# EAGLE design IRAMX-drv-v2 (EAGLE 6.5.0)
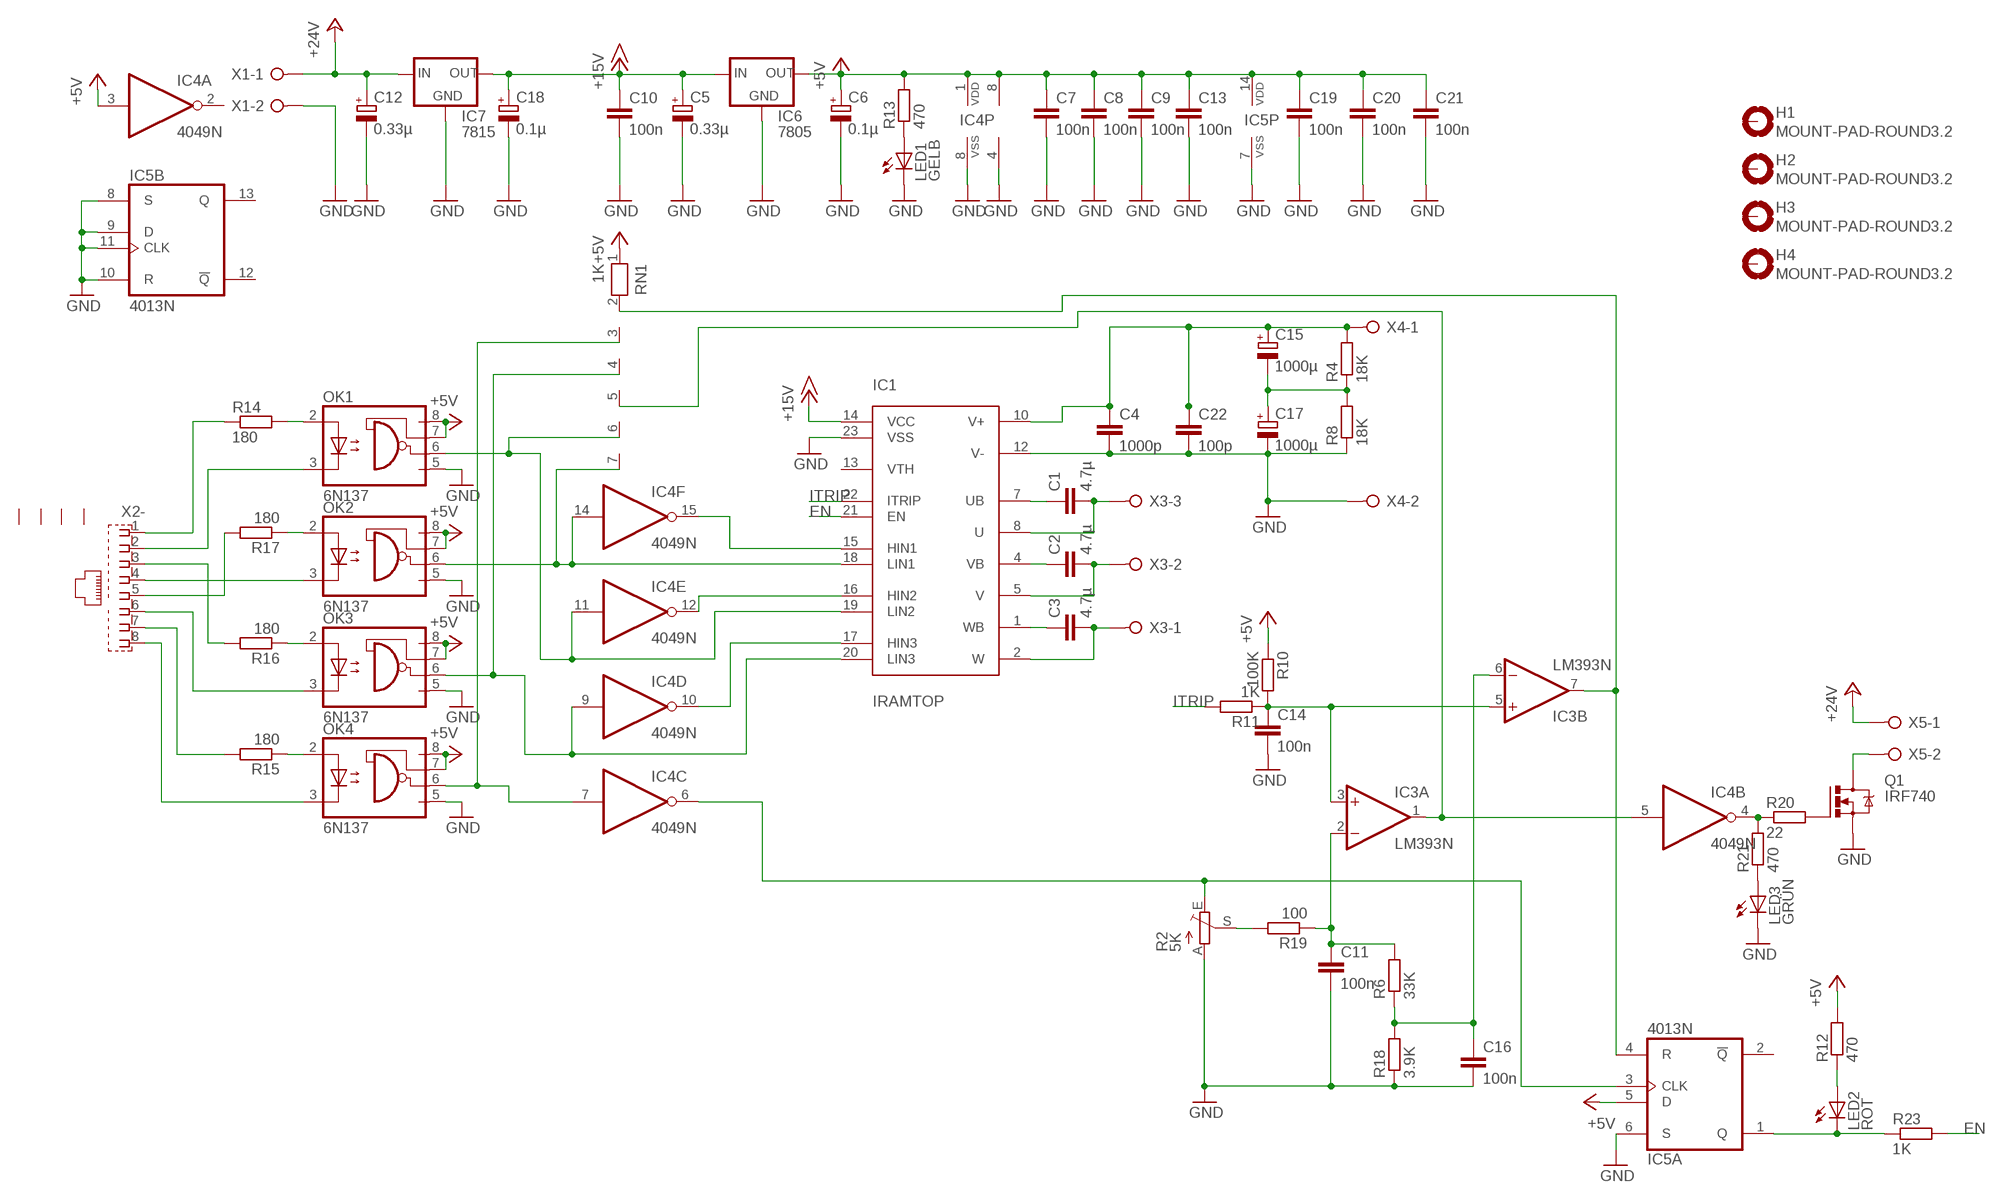
[diagram p0: schematic, sheet 1]

## Parts
C1  4.7µ  C5/7.2  [C5B7.2]
C2  4.7µ  C5/7.2  [C5B7.2]
C3  4.7µ  C5/7.2  [C5B7.2]
C4  1000p  C5/5  [C5B5]
C5  0.33µ  CPOL-EUE2.5-5  [E2,5-5]
C6  0.1µ  CPOL-EUE2.5-5  [E2,5-5]
C7  100n  C-EU050-025X075  [C050-025X075]
C8  100n  C-EU050-025X075  [C050-025X075]
C9  100n  C-EU050-025X075  [C050-025X075]
C10  100n  C-EU050-025X075  [C050-025X075]
C11  100n  C-EU050-025X075  [C050-025X075]
C12  0.33µ  CPOL-EUE2.5-5  [E2,5-5]
C13  100n  C-EU050-025X075  [C050-025X075]
C14  100n  C-EU050-025X075  [C050-025X075]
C15  1000µ  CPOL-EUE10-25  [EB25D]
C16  100n  C-EU050-025X075  [C050-025X075]
C17  1000µ  CPOL-EUE10-25  [EB25D]
C18  0.1µ  CPOL-EUE2.5-5  [E2,5-5]
C19  100n  C-EU050-025X075  [C050-025X075]
C20  100n  C-EU050-025X075  [C050-025X075]
C21  100n  C-EU050-025X075  [C050-025X075]
C22  100p  C-EU150-054X183  [C150-054X183]
H1  MOUNT-PAD-ROUND3.2  [3,2-PAD]
H2  MOUNT-PAD-ROUND3.2  [3,2-PAD]
H3  MOUNT-PAD-ROUND3.2  [3,2-PAD]
H4  MOUNT-PAD-ROUND3.2  [3,2-PAD]
IC1  IRAMTOP  [SIP23_TOP]
IC3  LM393N  [DIL08]
IC4  4049N  [DIL16]
IC5  4013N  [DIL14]
IC6  7805  78XXS  [78XXS]
IC7  7815  78XXS  [78XXS]
LED1  GELB  LED5MM  [LED5MM]
LED2  ROT  LED5MM  [LED5MM]
LED3  GRÜN  LED5MM  [LED5MM]
OK1  6N137  [DIL08]
OK2  6N137  [DIL08]
OK3  6N137  [DIL08]
OK4  6N137  [DIL08]
Q1  IRF740  [TO220BV]
R2  5K  TRIM_EU-CA6V  [CA6V]
R4  18K  R-EU_  [CER]
R6  33K  R-EU_0204/7  [0204/7]
R8  18K  R-EU_  [CER]
R10  100K  R-EU_0204/7  [0204/7]
R11  1K  R-EU_0204/7  [0204/7]
R12  470  R-EU_0204/7  [0204/7]
R13  470  R-EU_0204/7  [0204/7]
R14  180  R-EU_0204/2V  [0204V]
R15  180  R-EU_0204/2V  [0204V]
R16  180  R-EU_0204/2V  [0204V]
R17  180  R-EU_0204/2V  [0204V]
R18  3.9K  R-EU_0204/7  [0204/7]
R19  100  R-EU_0204/7  [0204/7]
R20  22  R-EU_0204/7  [0204/7]
R21  470  R-EU_0204/7  [0204/7]
R23  1K  R-EU_0204/7  [0204/7]
RN1  1K  RN06  [RN-7]
X1  W237-02P  [W237-132]
X2  RJ45  [RJ45]
X3  W237-03P  [W237-133]
X4  W237-02P  [W237-132]
X5  W237-02P  [W237-132]

## Nets
+5V: C6.+ C7.1 C8.1 C9.1 C13.1 C19.1 C20.1 C21.1 IC3.8(P:V+) IC4.1(P:VDD) IC4.3(A:I) IC5.5(A:D) IC5.14(P:VDD) IC6.OUT OK1.7(VE) OK1.8(VCC) OK2.7(VE) OK2.8(VCC) OK3.7(VE) OK3.8(VCC) OK4.7(VE) OK4.8(VCC) R10.1 R12.2 R13.2 RN1.1
+15V: C5.+ C10.1 C18.+ IC1.14(VCC) IC6.IN IC7.OUT
+24V: C12.+ IC7.IN X1.1 X5.1
EN: IC1.21(EN) R23.2
GND: C4.2 C5.- C6.- C7.2 C8.2 C9.2 C10.2 C11.2 C12.- C13.2 C14.2 C16.2 C17.- C18.- C19.2 C20.2 C21.2 C22.2 IC1.12(V-) IC1.23(VSS) IC3.4(P:V-) IC4.8(P:VSS) IC5.6(A:S) IC5.7(P:VSS) IC5.8(B:S) IC5.9(B:D) IC5.10(B:R) IC5.11(B:CLK) IC6.GND IC7.GND LED1.K(C) LED3.K(C) OK1.5(GND) OK2.5(GND) OK3.5(GND) OK4.5(GND) Q1.S R2.A R8.P$1 R18.1 X1.2 X4.2
ITRIP: IC1.22(ITRIP) R11.2
N$1 [iso]: C1.1 IC1.7(UB)
N$2 [dick]: C1.2 IC1.8(U) X3.3
N$3 [iso]: C2.1 IC1.4(VB)
N$4 [dick]: C2.2 IC1.5(V) X3.2
N$5 [iso]: C3.1 IC1.1(WB)
N$6 [dick]: C3.2 IC1.2(W) X3.1
N$7: LED2.A R12.1
N$8: C14.1 IC3.3(A:+IN) IC3.5(B:+IN) R10.2 R11.1
N$9: LED3.A R21.1
N$10: IC3.1(A:OUT) IC4.5(B:I) RN1.5
N$11 [dick]: C15.- C17.+ R4.P$1 R8.P$2
N$12: IC1.15(HIN1) IC4.15(F:O)
N$13: IC1.16(HIN2) IC4.12(E:O)
N$14: IC4.6(C:O) IC5.3(A:CLK) R2.E
N$15: IC1.17(HIN3) IC4.10(D:O)
N$16: OK3.3(C) X2.6
N$17: R16.2 X2.3
N$18: OK4.3(C) X2.8
N$19: OK2.3(C) X2.4
N$20: OK1.3(C) X2.2
N$21: OK1.2(A) R14.2
N$22: R17.2 X2.5
N$23: R15.2 X2.7
N$24: IC1.18(LIN1) IC4.14(F:I) OK2.6(VO) RN1.7
N$25: R2.S R19.2
N$26: Q1.D X5.2
N$27: C11.1 IC3.2(A:-IN) R6.2 R19.1
N$28: IC5.1(A:Q) LED2.K(C) R23.1
N$29: IC4.7(C:I) OK4.6(VO) RN1.3
N$31: R14.1 X2.1
N$32: OK4.2(A) R15.1
N$33: OK3.2(A) R16.1
N$34: OK2.2(A) R17.1
N$35: IC1.19(LIN2) IC4.11(E:I) OK1.6(VO) RN1.6
N$36: C16.1 IC3.6(B:-IN) R6.1 R18.2
N$37 [dick]: C4.1 C15.+ C22.1 IC1.10(V+) R4.P$2 X4.1
N$38: IC1.20(LIN3) IC4.9(D:I) OK3.6(VO) RN1.4
N$39: IC4.4(B:O) R20.1 R21.2
N$40: Q1.G R20.2
N$42: IC3.7(B:OUT) IC5.4(A:R) RN1.2
N$43: LED1.A R13.1
Unconnected: H1.B3,2(MOUNT) H2.B3,2(MOUNT) H3.B3,2(MOUNT) H4.B3,2(MOUNT) IC1.13(VTH) IC4.2(A:O) IC5.2(A:!Q) IC5.12(B:!Q) IC5.13(B:Q) X2.G1 X2.G2 X2.G3 X2.G4

## Library data of the parts
C1-C4 = capacitor-wima:C: CAPACITOR naming: grid - package width
C5 C6 C12 C15 C17 C18 = rcl:CPOL-EU: POLARIZED CAPACITOR, European symbol
C7-C11 C13 C14 C16 C19-C22 = rcl:C-EU: CAPACITOR, European symbol
H1-H4 = holes:MOUNT-PAD-ROUND: MOUNTING PAD, round
IC1 = iram-b:IRAM
IC3 = linear:LM393: COMPARATOR
IC4 = 40xx:4049: Hex inverting BUFFER
IC5 = 40xx:4013: Dual D FLIP FLOP, set/reset
IC6 IC7 = v-reg:78XXS: VOLTAGE REGULATOR
LED1-LED3 = led:LED: LED OSRAM: - CHIPLED LG R971, LG N971, LY N971, LG Q971, LY Q971, LO R971, LY R971 LH N974, LH R974 LS Q976, LO Q976, LY Q976 LO Q996 - Hyper CHIPLED LW Q18S LB Q993, LB Q99A, LB R99A - SideLED LS A670, LO A670, LY A670, LG A670, LP A670 LB A673, LV A673, LT A673, LW A673 LH A674 LY A675 LS A676, LA A676, LO A676, LY A676, LW A676 LS A679, LY A679, LG A679 - Hyper Micro SIDELED® LS Y876, LA Y876, LO Y876, LY Y876 LT Y87S - SmartLED LW L88C, LW L88S LB L89C, LB L89S, LG L890 LS L89K, LO L89K, LY L89K LS L896, LA L896, LO L896, LY L896 - TOPLED LS T670, LO T670, LY T670, LG T670, LP T670 LSG T670, LSP T670, LSY T670, LOP T670, LYG T670 LG T671, LOG T671, LSG T671 LB T673, LV T673, LT T673, LW T673 LH T674 LS T676, LA T676, LO T676, LY T676, LB T676, LH T676, LSB T676, LW T676 LB T67C, LV T67C, LT T67C, LS T67K, LO T67K, LY T67K, LW E67C LS E67B, LA E67B, LO E67B, LY E67B, LB E67C, LV E67C, LT E67C LW T67C LS T679, LY T679, LG T679 LS T770, LO T770, LY T770, LG T770, LP T770 LB T773, LV T773, LT T773, LW T773 LH T774 LS E675, LA E675, LY E675, LS T675 LS T776, LA T776, LO T776, LY T776, LB T776 LHGB T686 LT T68C, LB T68C - Hyper Mini TOPLED® LB M676 - Mini TOPLED Santana® LG M470 LS M47K, LO M47K, LY M47K Source: http://www.osram.convergy.de LUXEON: - LUMILED® LXK2-PW12-R00, LXK2-PW12-S00, LXK2-PW14-U00, LXK2-PW14-V00 LXK2-PM12-R00, LXK2-PM12-S00, LXK2-PM14-U00 LXK2-PE12-Q00, LXK2-PE12-R00, LXK2-PE12-S00, LXK2-PE14-T00, LXK2-PE14-U00 LXK2-PB12-K00, LXK2-PB12-L00, LXK2-PB12-M00, LXK2-PB14-N00, LXK2-PB14-P00, LXK2-PB14-Q00 LXK2-PR12-L00, LXK2-PR12-M00, LXK2-PR14-Q00, LXK2-PR14-R00 LXK2-PD12-Q00, LXK2-PD12-R00, LXK2-PD12-S00 LXK2-PH12-R00, LXK2-PH12-S00 LXK2-PL12-P00, LXK2-PL12-Q00, LXK2-PL12-R00 Source: www.luxeon.com KINGBRIGHT: KA-3528ASYC Source: www.kingbright.com
OK1-OK4 = optocoupler:6N137: MOTOROLA OPTO COUPLER; MPN: 6N137; OC_FARNELL: 1328376; OC_NEWARK: 52M1895
Q1 = transistor-power:IRF740: N-CHANNEL MOS FET
R2 = pot:TRIM_EU-: POTENTIOMETER
R4 R8 = reroolib:R-EU_: RESISTOR, European symbol
R6 R10-R21 R23 = rcl:R-EU_: RESISTOR, European symbol
RN1 = resistor-net:RN06: RESISTOR NETWORK; OC_FARNELL: unknown; OC_NEWARK: unknown
X1 X4 X5 = con-wago-508:W237-02P: WAGO SREW CLAMP; OC_FARNELL: unknown; OC_NEWARK: unknown
X2 = con-appsys:RJ45: AMP connector
X3 = con-wago-508:W237-03P: WAGO SREW CLAMP; OC_FARNELL: unknown; OC_NEWARK: unknown

## Net classes
0 default: width 0.406 mm, clearance 0.2 mm
1 dick: width 2 mm, clearance 0.5 mm
2 iso: width 0.5 mm, clearance 0.5 mm

## Board
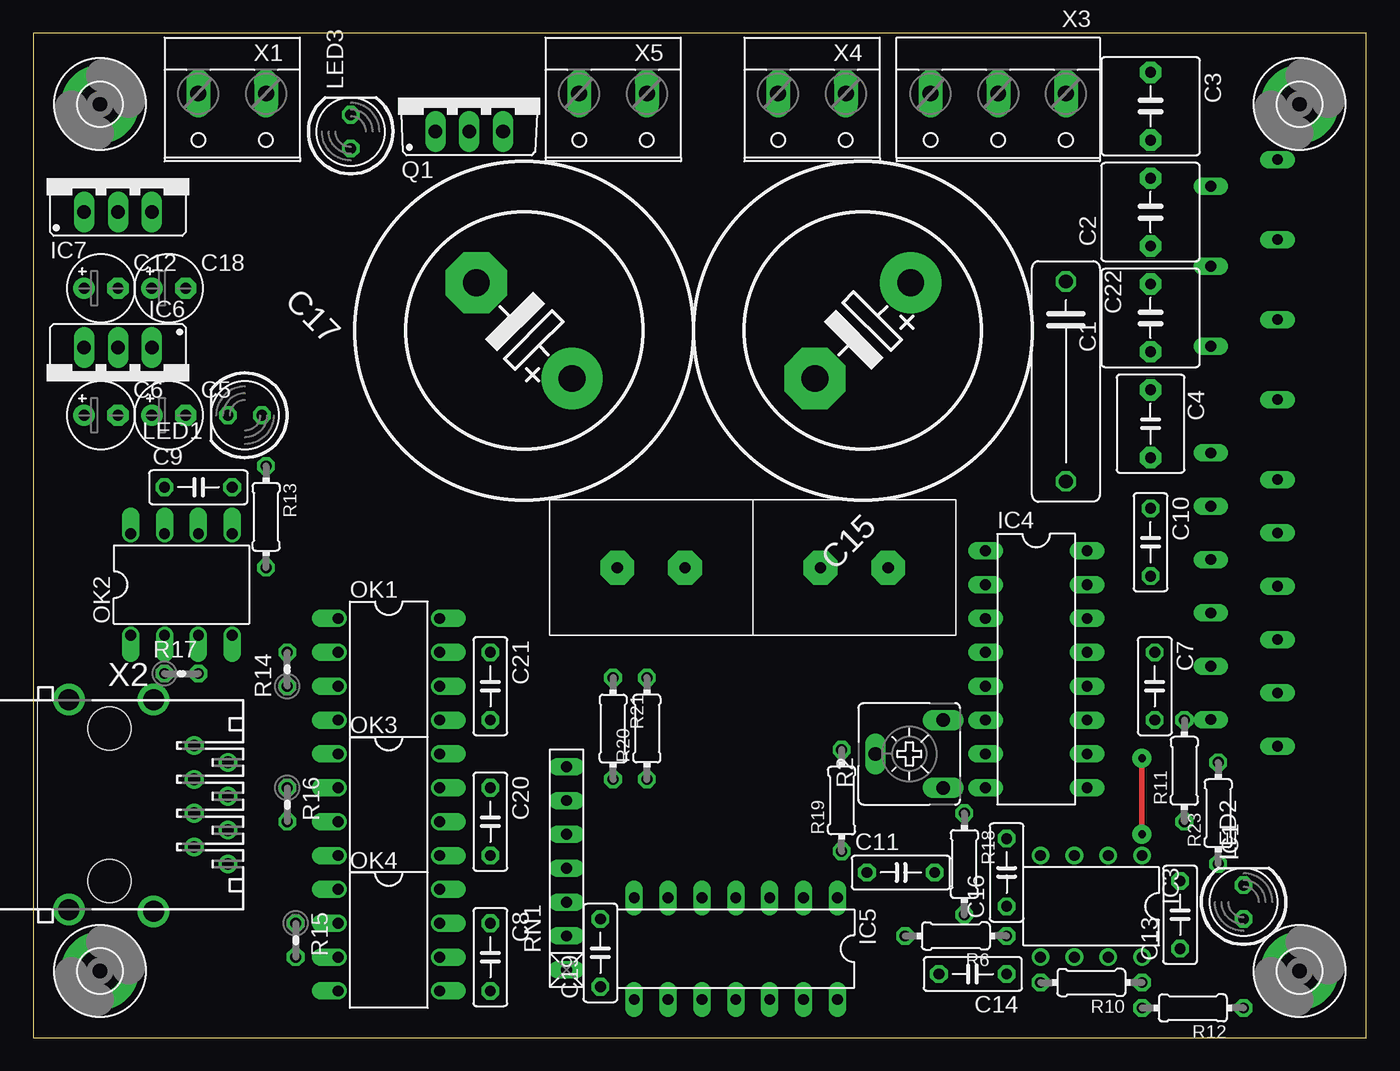
[diagram p1: board, top side]
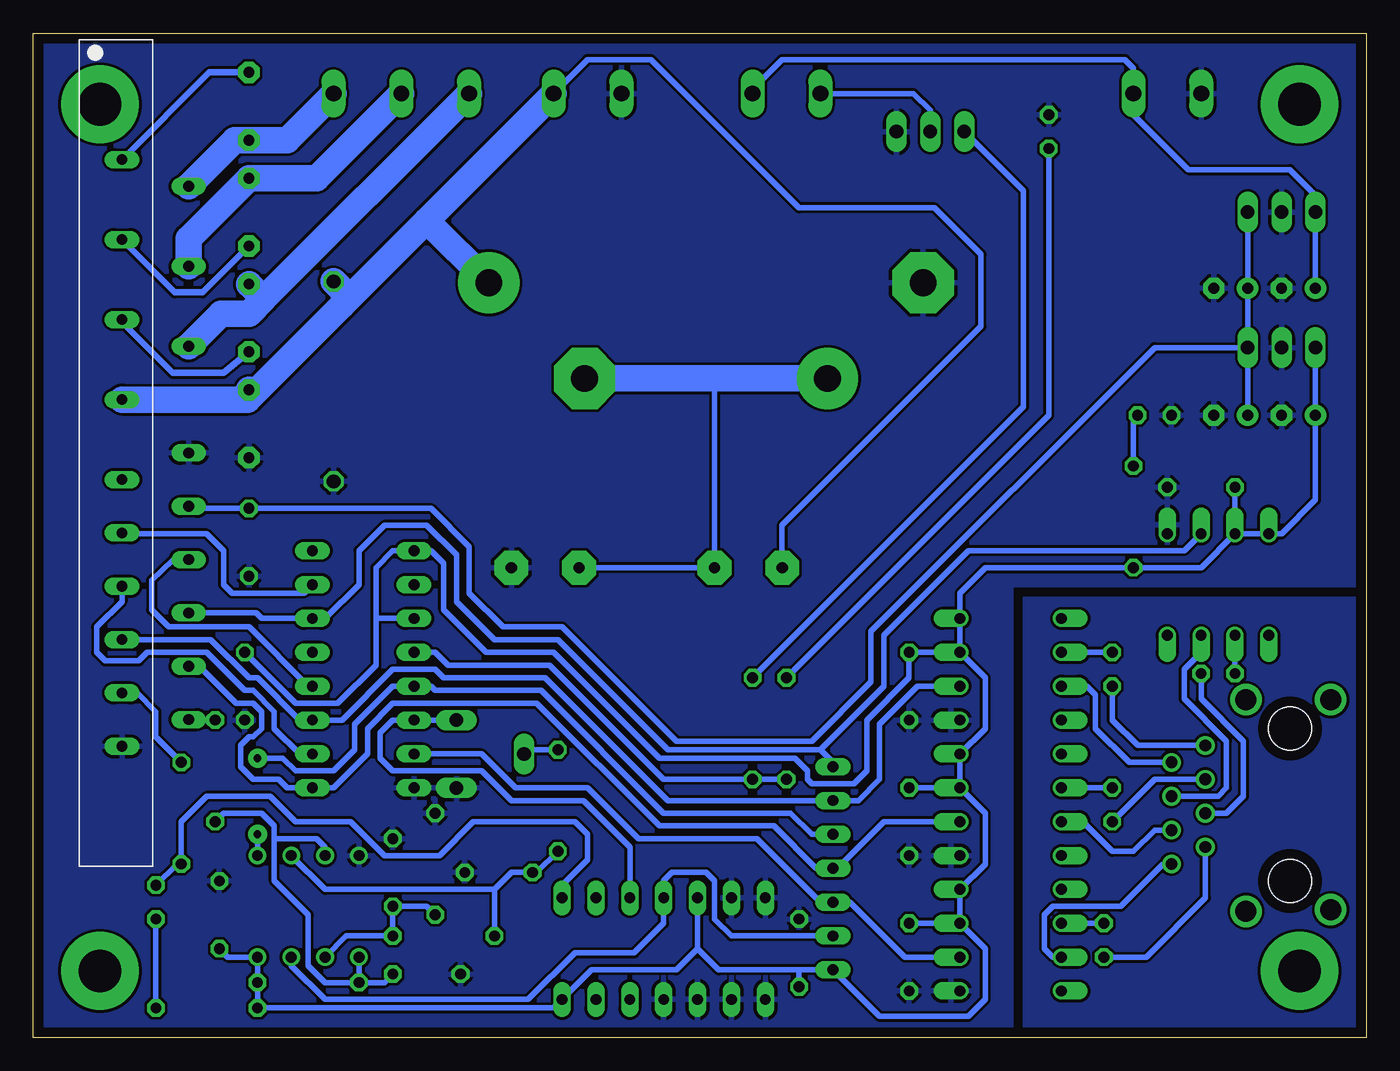
[diagram p2: board, bottom side, seen from below]

Size 100 x 75.32 mm. Coordinates in mm from the lower left corner, seen from the top.
Outline: 0,0 100,0 100,75.32 0,75.32 0,0
Copper layers (1*16): Top 0.035mm / dielectric 1.5mm / Bottom 0.035mm
Design rules "cnc *": minimum track width 10mil, minimum drill 0.1mm, track to track 0.15mm, track to pad 0.15mm, pad to pad 0.15mm, via to via 0.15mm, smd to smd 0.15mm, copper to edge 30mil, drill to drill 8mil, minimum pad ring 10mil, minimum via ring 8mil, stop-mask expansion 4mil, vias tented up to drill 0mil, thermal gap 10mil

### Footprints (pad centres in the part's own frame; a part is rotated, then mirrored left to right if it is on the bottom)
C5B7.2 = drill 0.813 pad 1.6 octagon: 1 -2.54,0; 2 2.54,0
C5B5 = drill 0.813 pad 1.6 octagon: 1 -2.54,0; 2 2.54,0
E2,5-5 = drill 0.813 pad 1.6: + -1.27,0 | drill 0.813 pad 1.6 octagon: - 1.27,0
C050-025X075 = drill 0.813 octagon: 1 -2.54,0; 2 2.54,0
EB25D = drill 2.007 pad 4.597: + -5.08,0 | drill 2.007 pad 4.597 octagon: - 5.08,0
C150-054X183 = drill 1.016 octagon: 1 -7.493,0; 2 7.493,0
3,2-PAD = drill 3.2 pad 5.842: B3,2 0,0
SIP23_TOP = drill 0.8 long: 1 2.03,-5.08; 2 0.03,-0.08; 4 -3.97,-5.08; 5 -5.97,-0.08; 7 -9.97,-5.08; 8 -11.97,-0.08; 10 -15.97,-5.08; 12 -19.97,-0.08; 13 -21.97,-5.08; 14 -23.97,-0.08; 15 -25.97,-5.08; 16 -27.97,-0.08; 17 -29.97,-5.08; 18 -31.97,-0.08; 19 -33.97,-5.08; 20 -35.97,-0.08; 21 -37.97,-5.08; 22 -39.97,-0.08; 23 -41.97,-5.08
DIL08 = drill 0.813 pad 1.27: 1 -3.81,-3.81; 2 -1.27,-3.81; 3 1.27,-3.81; 4 3.81,-3.81; 5 3.81,3.81; 6 1.27,3.81; 7 -1.27,3.81; 8 -3.81,3.81
DIL16 = drill 0.813 long: 1 -8.89,-3.81; 2 -6.35,-3.81; 3 -3.81,-3.81; 4 -1.27,-3.81; 5 1.27,-3.81; 6 3.81,-3.81; 7 6.35,-3.81; 8 8.89,-3.81; 9 8.89,3.81; 10 6.35,3.81; 11 3.81,3.81; 12 1.27,3.81; 13 -1.27,3.81; 14 -3.81,3.81; 15 -6.35,3.81; 16 -8.89,3.81
DIL14 = drill 0.813 long: 1 -7.62,-3.81; 2 -5.08,-3.81; 3 -2.54,-3.81; 4 0,-3.81; 5 2.54,-3.81; 6 5.08,-3.81; 7 7.62,-3.81; 8 7.62,3.81; 9 5.08,3.81; 10 2.54,3.81; 11 0,3.81; 12 -2.54,3.81; 13 -5.08,3.81; 14 -7.62,3.81
78XXS = drill 1.016 long: GND 0,-2.54; IN -2.54,-2.54; OUT 2.54,-2.54
LED5MM = drill 0.813 octagon: A -1.27,0; K 1.27,0
DIL08' = drill 0.813 offset: 1 -3.81,-3.81; 2 -1.27,-3.81; 3 1.27,-3.81; 4 3.81,-3.81; 5 3.81,3.81; 6 1.27,3.81; 7 -1.27,3.81; 8 -3.81,3.81
TO220BV = drill 1.016 long: D 0,-2.54; G -2.54,-2.54; S 2.54,-2.54
CA6V = drill 1.016 long: A -2.54,-2.54; E 2.54,-2.54; S 0,2.54
CER = drill 0.85 pad 2.54 octagon: P$1 -2.54,0; P$2 2.54,0
0204/7 = drill 0.813 octagon: 1 -3.81,0; 2 3.81,0
0204V = drill 0.813 octagon: 1 -1.27,0; 2 1.27,0
RN-7 = drill 0.813 long: 1 -7.62,0; 2 -5.08,0; 3 -2.54,0; 4 0,0; 5 2.54,0; 6 5.08,0; 7 7.62,0
W237-132 = drill 1.194 long: 1 -2.54,-0.635; 2 2.54,-0.635
RJ45 = drill 0.889: 1 -4.445,6.35; 2 -3.175,8.89; 3 -1.905,6.35; 4 -0.635,8.89; 5 0.635,6.35; 6 1.905,8.89; 7 3.175,6.35; 8 4.445,8.89 | drill 1.575 pad 2.184: G1 -7.874,-3.048; G2 7.874,-3.048; G3 -7.874,3.302; G4 8.001,3.302 | hole 3.251: -5.715,0; 5.715,0
W237-133 = drill 1.194 long: 1 -5.08,-0.635; 2 0,-0.635; 3 5.08,-0.635

### Placement (x,y rotation side)
C1  83.82,53.98 90 top
C2  83.82,61.91 90 top
C3  83.82,69.85 270 top
C4  83.82,46.04 270 top
C5  10.16,46.67 0 top
C6  5.08,46.67 0 top
C7  84.14,26.35 270 top
C8  34.29,6.03 270 top
C9  12.38,41.27 0 top
C10  83.82,37.15 270 top
C11  65.09,12.38 0 top
C12  5.08,56.2 0 top
C13  86.04,9.21 90 top
C14  70.48,4.76 180 top
C15  62.23,53.02 225 top
C16  73.03,12.38 90 top
C17  36.83,53.02 135 top
C18  10.16,56.2 0 top
C19  42.55,6.35 90 top
C20  34.29,16.19 270 top
C21  34.29,26.35 270 top
C22  77.47,49.21 270 top
H1  95,70 0 top
H2  95,5 0 top
H3  5,5 0 top
H4  5,70 0 top
IC1  88.27,63.82 90 top
IC3  79.38,9.84 180 top
IC4  75.25,27.62 270 top
IC5  52.7,6.67 180 top
IC6  6.35,49.21 180 top
IC7  6.35,64.45 0 top
LED1  15.88,46.67 180 top
LED2  90.81,10.16 90 top
LED3  23.81,67.94 90 top
OK1  6N137  [DIL08']  26.67,27.62 270 top
OK2  6N137  [DIL08']  11.11,33.97 0 top
OK3  6N137  [DIL08']  26.67,17.46 270 top
OK4  6N137  [DIL08']  26.67,7.3 270 top
Q1  32.7,70.48 0 top
R2  65.72,21.27 90 top
R4  46.35,35.24 180 top
R6  69.22,7.62 180 top
R8  61.59,35.24 180 top
R10  79.38,4.13 180 top
R11  86.36,20 90 top
R12  87,2.22 180 top
R13  17.46,39.05 270 top
R14  19.05,27.62 90 top
R15  19.68,7.3 270 top
R16  19.05,17.46 270 top
R17  11.11,27.3 0 top
R18  69.85,13.02 270 top
R19  60.64,17.78 90 top
R20  46.04,23.18 90 top
R21  43.5,23.18 270 top
R23  88.9,16.83 90 top
RN1  40.01,12.7 90 top
X1  14.92,70.17 180 top
X2  5.71,17.46 270 top
X3  72.39,70.17 180 top
X4  58.42,70.17 180 top
X5  43.5,70.17 180 top

### Tracks (layer width: path | path; a pad name or v marks a point on that pad's centre or on a via)
+5V
  Bottom 0.406: IC6.OUT C6.+ 3.81,40.32 6.35,37.78 OK2.8 OK2.7 | OK1.7 OK1.8 30.48,33.34 28.57,35.24 R13.2 12.38,35.24 OK2.7 | OK4.7 OK4.8 28.57,13.02 28.57,16.83 OK3.7 | OK3.7 OK3.8 28.57,23.18 28.57,26.99 OK1.7 | C13.1 85.41,6.03 IC3.8 R10.1 R12.2 60.96,2.22 IC5.14 58.1,5.08 51.75,5.08 50.16,6.67 | OK4.7 C8.1 | OK4.7 28.57,6.67 28.57,2.86 29.84,1.59 36.51,1.59 RN1.1 42.55,5.08 | C20.1 OK3.7 | IC5.5 50.16,6.67 | OK1.7 C21.1 34.29,26.99 37.47,23.81 37.47,20 38.42,19.05 41.59,19.05 41.91,19.37 41.91,20 42.86,20.95 53.02,20.95 60.96,28.89 66.04,28.89 69.22,32.07 69.22,35.56 70.17,36.51 IC4.1 73.03,36.51 74.3,35.24 74.3,31.43 | IC4.3 74.3,31.43 | C7.1 80.33,25.08 77.15,25.08 74.3,27.94 74.3,31.43 | C9.1 OK2.7 | 42.55,5.08 48.58,5.08 50.16,6.67 | C19.1 42.55,5.08
+15V
  Bottom 0.406: IC7.OUT C18.+ IC6.IN | IC1.14 87.55,39.69 C10.1 70.17,39.69 67.31,36.83 67.31,33.34 64.77,30.8 60.33,30.8 51.75,22.23 41.59,22.23 37.15,26.67 37.15,30.48 15.88,51.75 IC6.IN | C5.+ IC6.IN
+24V
  Bottom 0.406: C12.+ IC7.IN 3.81,63.18 5.71,65.09 13.34,65.09 17.46,69.22 X1.1 17.46,72.71 18.1,73.34 43.81,73.34 46.04,71.12 X5.1
EN
  Bottom 0.406: R23.2 90.81,22.54 90.81,24.45 92.2,25.85 IC1.21
FOO
  pour Bottom (rank 6): 0.32,33.02 25.72,33.02 25.72,0.32 0.32,0.32
GND
  pour Bottom: 0,74.93 100.33,74.93 100.01,0 26.67,0.32 26.67,33.97 0,33.97
ITRIP
  Bottom 0.406: R11.2 88.34,23.81 IC1.22
N$1
  Bottom 0.5: IC1.7 93.34,53.66 89.53,49.85 85.72,49.85 C1.1
N$2
  Bottom 2: X3.3 82.71,55.4 | 82.71,55.4 83.82,54.29 85.9,54.29 IC1.8 | C1.2 82.71,55.4
N$3
  Bottom 0.5: C2.1 87.31,55.88 89.38,55.88 IC1.4
N$4
  Bottom 2: IC1.5 88.34,59.93 C2.2 78.74,64.45 X3.2
N$5
  Bottom 0.5: C3.1 86.8,72.39 IC1.1
N$6
  Bottom 2: X3.1 80.96,67.31 C3.2 84.88,67.31 IC1.2
N$7
  Bottom 0.406: LED2.A R12.1
N$8
  Bottom 0.406: R10.2 73.66,4.13 C14.1 | IC3.3 78.11,14.29 78.74,14.92 81.92,14.92 | 81.92,14.92 81.92,11.75 79.38,9.21 79.38,5.4 78.11,4.13 R10.2 | IC3.5 R10.2 | 81.92,14.92 81.92,15.88 82.87,16.83 85.72,16.83 R11.1
N$9
  Bottom 0.406: R21.1 23.81,46.67 LED3.A
N$10  (via drill 0.58 pad 1.42)
  Top 0.406: v83.19,15.24 v83.19,20.95
  Bottom 0.406: v83.19,20.95 81.28,20.95 80.33,20 77.47,20 75.88,21.59 75.88,23.5 73.03,26.35 IC4.5 70.17,26.35 69.85,26.04 61.91,26.04 52.7,16.83 43.18,16.83 41.59,15.24 RN1.5 | IC3.1 v83.19,15.24
N$11
  Bottom 0.406: R8.P$2 R4.P$1 48.9,49.43
  Bottom 2: C15.- 48.9,49.43 C17.+
N$12
  Bottom 0.406: IC4.15 79.69,33.34 85.09,33.34 85.72,33.97 85.72,36.51 87,37.78 93.28,37.78 IC1.15
N$13
  Bottom 0.406: IC1.16 89.5,35.85 91.12,34.29 91.12,32.07 89.85,30.8 83.82,30.8 79.38,26.35 IC4.12
N$14
  Bottom 0.406: R2.E IC4.6 73.03,23.81 73.98,22.86 73.98,20.95 73.03,20 66.36,20 64.14,17.78 58.74,17.78 55.24,14.29 IC5.3
N$15
  Bottom 0.406: IC1.17 93.34,32.7 95.25,30.8 95.25,28.89 94.61,28.26 92.08,28.26 91.44,28.89 87,28.89 84.14,26.04 83.5,26.04 81.92,24.45 81.92,23.18 80.01,21.27 IC4.10
N$16
  Bottom 0.406: OK3.3 21.27,16.19 19.05,13.97 17.46,13.97 15.88,15.56 X2.6
N$17
  Bottom 0.406: X2.3 15.88,19.37 R16.2
N$18
  Bottom 0.406: OK4.3 23.5,6.03 24.13,6.67 24.13,9.21 23.5,9.84 18.41,9.84 15.24,13.02 X2.8
N$19
  Bottom 0.406: X2.4 11.11,18.1 10.48,18.73 10.48,22.23 13.65,25.4 13.65,27.62 12.38,28.89 OK2.3
N$20
  Bottom 0.406: OK1.3 20.95,26.35 20.32,25.72 20.32,23.18 17.78,20.64 X2.2
N$21
  Bottom 0.406: R14.2 OK1.2
N$22
  Bottom 0.406: R17.2 12.38,25.4 9.21,22.23 9.21,18.1 10.48,16.83 X2.5
N$23
  Bottom 0.406: X2.7 12.06,10.48 16.51,6.03 R15.2
N$24
  Bottom 0.406: IC1.18 83.28,31.85 82.87,31.43 IC4.14 78.11,31.43 75.56,33.97 75.56,36.51 73.66,38.42 70.48,38.42 68.26,36.2 68.26,32.7 65.41,29.84 60.64,29.84 52.39,21.59 40.96,21.59 | OK2.6 13.65,36.51 29.84,36.51 36.2,30.16 36.2,26.35 40.96,21.59 | RN1.7 40.01,20.64 40.96,21.59
N$25
  Bottom 0.406: R2.S 63.18,21.59 R19.2
N$26
  Bottom 0.406: Q1.D 32.7,69.53 33.97,70.8 X5.2
N$27
  Bottom 0.406: R19.1 62.23,12.38 C11.1 64.14,12.38 65.41,11.11 | 65.41,11.11 R6.2 | 65.41,11.11 78.11,11.11 IC3.2
N$28
  Bottom 0.406: IC5.1 60.33,11.43 58.42,13.34 58.42,15.24 59.37,16.19 66.99,16.19 69.53,13.65 73.66,13.65 76.2,16.19 80.33,16.19 82.23,18.1 87,18.1 88.9,16.19 R23.1 89.22,13.02 LED2.K
N$29
  Bottom 0.406: IC4.7 66.36,21.27 63.82,18.73 58.42,18.73 54.61,14.92 45.72,14.92 40.96,10.16 RN1.3 38.73,10.16 34.61,6.03 OK4.6
N$31
  Bottom 0.406: X2.1 17.14,21.91 19.05,23.81 R14.1
N$32
  Bottom 0.406: OK4.2 R15.1
N$33
  Bottom 0.406: R16.1 OK3.2
N$34
  Bottom 0.406: OK2.2 R17.1
N$35
  Bottom 0.406: 93.03,29.84 IC1.19 86.68,29.84 83.82,26.99 83.19,26.99 80.01,23.81 IC4.11 76.83,23.81 73.03,27.62 69.85,27.62 69.22,26.99 61.59,26.99 52.39,17.78 RN1.6 38.1,17.78 36.51,19.37 36.51,23.5 33.66,26.35 OK1.6
N$36
  Bottom 0.406: R18.2 70.48,9.84 C16.1 R6.1 76.52,7.62 IC3.6
N$37
  Bottom 0.406: X4.1 58.42,73.34 53.66,73.34 42.55,62.23 32.38,62.23 28.89,58.74 28.89,53.34 43.81,38.42 R4.P$2
  Bottom 2: IC1.10 84.14,47.85 | 84.14,47.85 83.92,47.85 76.83,54.93 | X4.1 70.48,61.28 | 70.48,61.28 76.83,54.93 | C15.+ 70.48,61.28 | C22.1 76.52,55.75 76.83,54.93 | C4.1 84.14,47.85
N$38
  Bottom 0.406: IC1.20 88.25,27.94 87.63,27.94 84.77,25.08 83.5,25.08 82.87,24.45 82.87,23.18 83.5,22.54 83.82,22.54 84.45,21.91 84.45,20.32 83.5,19.37 81.6,19.37 80.96,18.73 IC4.9 77.47,18.73 74.93,21.27 74.93,23.18 73.03,25.08 62.23,25.08 53.02,15.88 44.45,15.88 41.27,12.7 RN1.4 39.69,12.7 36.2,16.19 OK3.6
N$39
  Bottom 0.406: IC4.4 69.85,28.89 68.9,27.94 61.28,27.94 52.7,19.37 R21.2 R20.1
N$40
  Bottom 0.406: Q1.G 25.72,63.5 25.72,47.31 R20.2
N$42
  Bottom 0.406: IC3.7 80.64,5.4 78.11,2.86 62.87,2.86 59.37,6.35 54.93,6.35 52.7,8.57 IC5.4 52.7,11.75 52.07,12.38 49.53,12.38 48.9,11.75 48.9,8.89 47.62,7.62 RN1.2
N$43
  Bottom 0.406: R13.1 17.46,46.35 LED1.A